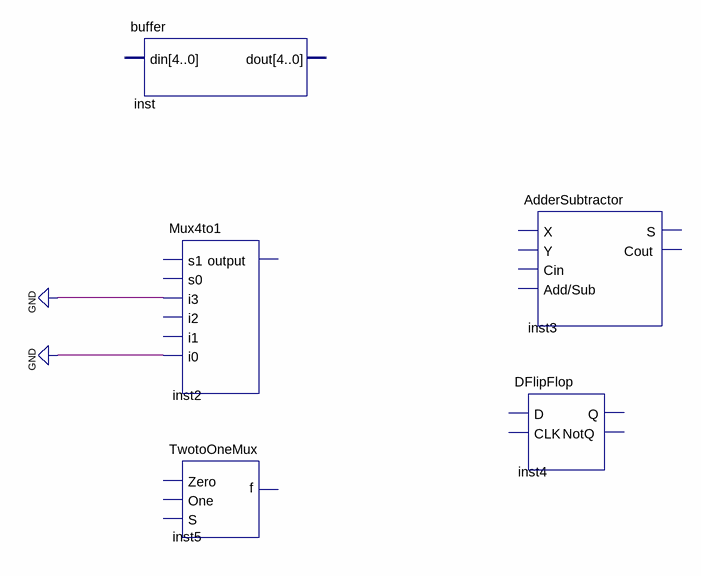
[diagram p0: schematic sheet]
// Quartus schematic CounterDrum.bdf as structural Verilog: 5 symbols, 0 pins
module CounterDrum (
);

  buffer inst ();  // open: din, dout
  Mux4to1 inst2 (.i3(1'b0), .i0(1'b0));  // open: s1, s0, i2, i1, output
  TwotoOneMux inst5 ();  // open: Zero, S, One, f
  AdderSubtractor inst3 ();  // open: X, Y, Cin, Add/Sub, S, Cout
  DFlipFlop inst4 ();  // open: D, CLK, Q, NotQ
endmodule
